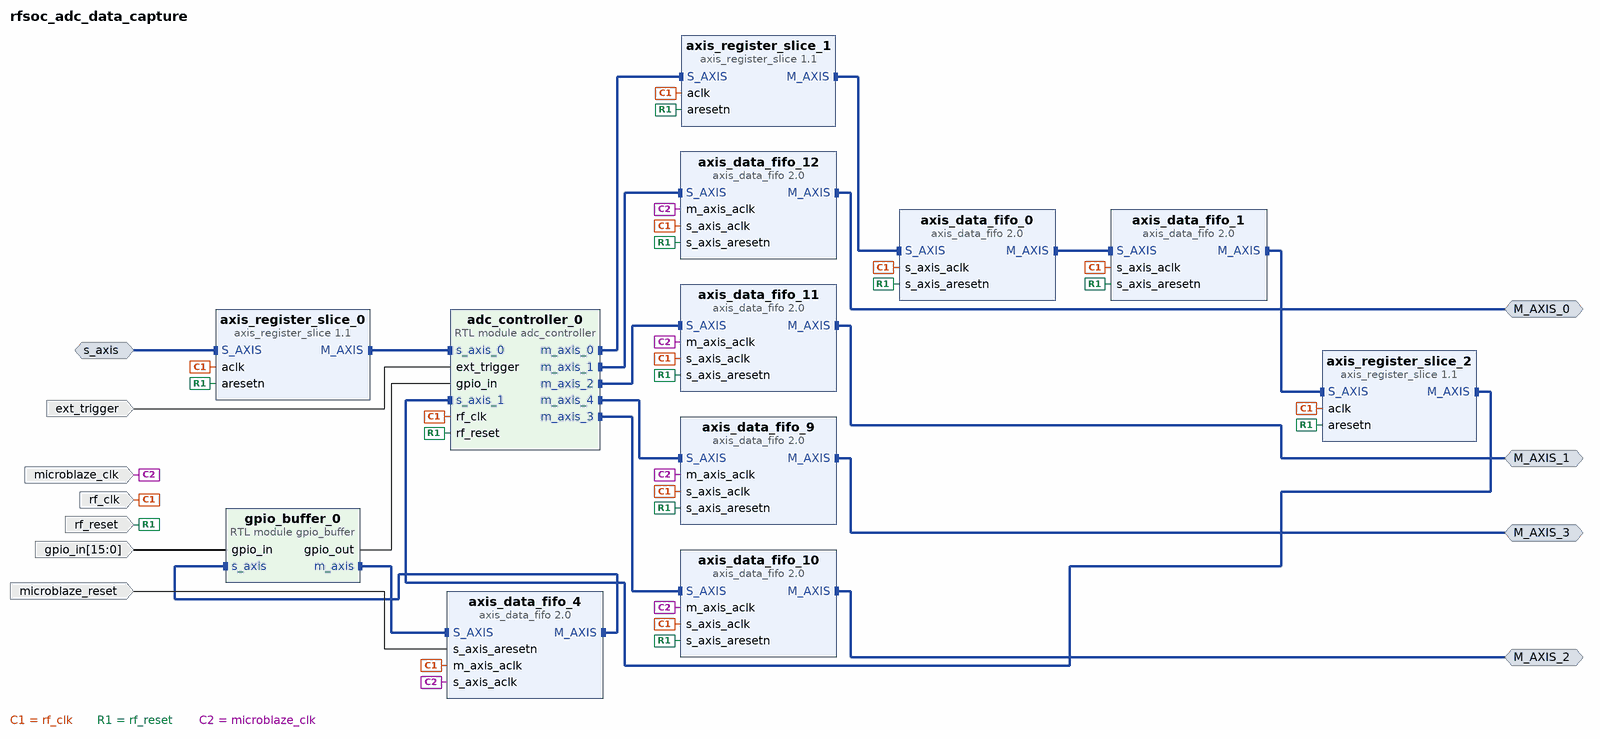
[diagram p0: block diagram of the top level]
# Vivado block design rfsoc_adc_data_capture, xczu29dr-ffvf1760-2-e, Vivado 2019.1
create_bd_design rfsoc_adc_data_capture

create_bd_intf_port -mode Slave -vlnv xilinx.com:interface:axis_rtl:1.0 s_axis
set_property -dict [list \
  CONFIG.FREQ_HZ 250000000 \
  CONFIG.HAS_TKEEP 0 \
  CONFIG.HAS_TLAST 0 \
  CONFIG.HAS_TREADY 1 \
  CONFIG.HAS_TSTRB 0 \
  CONFIG.LAYERED_METADATA undef \
  CONFIG.TDATA_NUM_BYTES 16 \
  CONFIG.TDEST_WIDTH 0 \
  CONFIG.TID_WIDTH 0 \
  CONFIG.TUSER_WIDTH 0 \
] [get_bd_intf_ports s_axis]
create_bd_intf_port -mode Master -vlnv xilinx.com:interface:axis_rtl:1.0 M_AXIS_0
create_bd_intf_port -mode Master -vlnv xilinx.com:interface:axis_rtl:1.0 M_AXIS_1
create_bd_intf_port -mode Master -vlnv xilinx.com:interface:axis_rtl:1.0 M_AXIS_2
create_bd_intf_port -mode Master -vlnv xilinx.com:interface:axis_rtl:1.0 M_AXIS_3
create_bd_port -dir I -type clk rf_clk
set_property -dict {CONFIG.ASSOCIATED_BUSIF s_axis CONFIG.FREQ_HZ 250000000} [get_bd_ports rf_clk]
create_bd_port -dir I -type rst rf_reset
create_bd_port -dir I ext_trigger
create_bd_port -dir I -type clk microblaze_clk
create_bd_port -dir I -type rst microblaze_reset
create_bd_port -dir I -from 15 -to 0 gpio_in

create_bd_cell -type ip -vlnv xilinx.com:ip:axis_data_fifo:2.0 axis_data_fifo_4
set_property -dict {CONFIG.FIFO_DEPTH 16 CONFIG.IS_ACLK_ASYNC 1} [get_bd_cells axis_data_fifo_4]
create_bd_cell -type ip -vlnv xilinx.com:ip:axis_register_slice:1.1 axis_register_slice_0
create_bd_cell -type ip -vlnv xilinx.com:ip:axis_data_fifo:2.0 axis_data_fifo_9
set_property -dict {CONFIG.FIFO_DEPTH 16 CONFIG.IS_ACLK_ASYNC 1 CONFIG.TDATA_NUM_BYTES 4} [get_bd_cells axis_data_fifo_9]
create_bd_cell -type ip -vlnv xilinx.com:ip:axis_data_fifo:2.0 axis_data_fifo_10
set_property -dict {CONFIG.FIFO_DEPTH 16 CONFIG.IS_ACLK_ASYNC 1 CONFIG.TDATA_NUM_BYTES 4} [get_bd_cells axis_data_fifo_10]
create_bd_cell -type ip -vlnv xilinx.com:ip:axis_data_fifo:2.0 axis_data_fifo_11
set_property -dict {CONFIG.FIFO_DEPTH 16 CONFIG.IS_ACLK_ASYNC 1 CONFIG.TDATA_NUM_BYTES 4} [get_bd_cells axis_data_fifo_11]
create_bd_cell -type ip -vlnv xilinx.com:ip:axis_data_fifo:2.0 axis_data_fifo_12
set_property -dict {CONFIG.FIFO_DEPTH 16 CONFIG.IS_ACLK_ASYNC 1 CONFIG.TDATA_NUM_BYTES 4} [get_bd_cells axis_data_fifo_12]
create_bd_cell -type ip -vlnv xilinx.com:ip:axis_data_fifo:2.0 axis_data_fifo_0
set_property -dict {CONFIG.FIFO_DEPTH 32768 CONFIG.TDATA_NUM_BYTES 16} [get_bd_cells axis_data_fifo_0]
create_bd_cell -type ip -vlnv xilinx.com:ip:axis_data_fifo:2.0 axis_data_fifo_1
set_property -dict {CONFIG.FIFO_DEPTH 32768 CONFIG.TDATA_NUM_BYTES 16} [get_bd_cells axis_data_fifo_1]
create_bd_cell -type module -reference adc_controller adc_controller_0
create_bd_cell -type module -reference gpio_buffer gpio_buffer_0
create_bd_cell -type ip -vlnv xilinx.com:ip:axis_register_slice:1.1 axis_register_slice_1
create_bd_cell -type ip -vlnv xilinx.com:ip:axis_register_slice:1.1 axis_register_slice_2

# ---- connections ----

connect_bd_intf_net [get_bd_intf_ports M_AXIS_3] [get_bd_intf_pins axis_data_fifo_9/M_AXIS]
connect_bd_intf_net [get_bd_intf_pins axis_data_fifo_0/M_AXIS] [get_bd_intf_pins axis_data_fifo_1/S_AXIS]
connect_bd_intf_net [get_bd_intf_pins gpio_buffer_0/s_axis] [get_bd_intf_pins axis_data_fifo_4/M_AXIS]
connect_bd_intf_net [get_bd_intf_pins adc_controller_0/m_axis_1] [get_bd_intf_pins axis_data_fifo_12/S_AXIS]
connect_bd_intf_net [get_bd_intf_pins axis_register_slice_0/M_AXIS] [get_bd_intf_pins adc_controller_0/s_axis_0]
connect_bd_intf_net [get_bd_intf_ports s_axis] [get_bd_intf_pins axis_register_slice_0/S_AXIS]
connect_bd_intf_net [get_bd_intf_pins adc_controller_0/m_axis_4] [get_bd_intf_pins axis_data_fifo_9/S_AXIS]
connect_bd_intf_net [get_bd_intf_pins adc_controller_0/m_axis_3] [get_bd_intf_pins axis_data_fifo_10/S_AXIS]
connect_bd_intf_net [get_bd_intf_pins gpio_buffer_0/m_axis] [get_bd_intf_pins axis_data_fifo_4/S_AXIS]
connect_bd_intf_net [get_bd_intf_pins adc_controller_0/m_axis_2] [get_bd_intf_pins axis_data_fifo_11/S_AXIS]
connect_bd_intf_net [get_bd_intf_ports M_AXIS_1] [get_bd_intf_pins axis_data_fifo_11/M_AXIS]
connect_bd_intf_net [get_bd_intf_ports M_AXIS_0] [get_bd_intf_pins axis_data_fifo_12/M_AXIS]
connect_bd_intf_net [get_bd_intf_ports M_AXIS_2] [get_bd_intf_pins axis_data_fifo_10/M_AXIS]
connect_bd_intf_net [get_bd_intf_pins axis_register_slice_1/M_AXIS] [get_bd_intf_pins axis_data_fifo_0/S_AXIS]
connect_bd_intf_net [get_bd_intf_pins axis_data_fifo_1/M_AXIS] [get_bd_intf_pins axis_register_slice_2/S_AXIS]
connect_bd_intf_net [get_bd_intf_pins axis_register_slice_2/M_AXIS] [get_bd_intf_pins adc_controller_0/s_axis_1]
connect_bd_intf_net [get_bd_intf_pins adc_controller_0/m_axis_0] [get_bd_intf_pins axis_register_slice_1/S_AXIS]
connect_bd_net -net rf_clk_0_1 [get_bd_ports rf_clk] \
  [get_bd_pins axis_data_fifo_4/m_axis_aclk] [get_bd_pins axis_register_slice_0/aclk] \
  [get_bd_pins axis_data_fifo_10/s_axis_aclk] [get_bd_pins axis_data_fifo_9/s_axis_aclk] \
  [get_bd_pins axis_data_fifo_11/s_axis_aclk] [get_bd_pins axis_data_fifo_12/s_axis_aclk] \
  [get_bd_pins axis_data_fifo_0/s_axis_aclk] [get_bd_pins axis_data_fifo_1/s_axis_aclk] [get_bd_pins adc_controller_0/rf_clk] \
  [get_bd_pins axis_register_slice_1/aclk] [get_bd_pins axis_register_slice_2/aclk]
connect_bd_net -net rf_reset_0_1 [get_bd_ports rf_reset] \
  [get_bd_pins axis_register_slice_0/aresetn] [get_bd_pins axis_data_fifo_12/s_axis_aresetn] \
  [get_bd_pins axis_data_fifo_11/s_axis_aresetn] [get_bd_pins axis_data_fifo_9/s_axis_aresetn] \
  [get_bd_pins axis_data_fifo_10/s_axis_aresetn] [get_bd_pins axis_data_fifo_0/s_axis_aresetn] \
  [get_bd_pins axis_data_fifo_1/s_axis_aresetn] [get_bd_pins adc_controller_0/rf_reset] \
  [get_bd_pins axis_register_slice_1/aresetn] [get_bd_pins axis_register_slice_2/aresetn]
connect_bd_net -net ext_trigger_0_1 [get_bd_ports ext_trigger] [get_bd_pins adc_controller_0/ext_trigger]
connect_bd_net [get_bd_ports microblaze_clk] \
  [get_bd_pins axis_data_fifo_4/s_axis_aclk] [get_bd_pins axis_data_fifo_10/m_axis_aclk] \
  [get_bd_pins axis_data_fifo_9/m_axis_aclk] [get_bd_pins axis_data_fifo_11/m_axis_aclk] \
  [get_bd_pins axis_data_fifo_12/m_axis_aclk]
connect_bd_net [get_bd_pins gpio_buffer_0/gpio_out] [get_bd_pins adc_controller_0/gpio_in]
connect_bd_net -net s_axis_aresetn_0_1 [get_bd_ports microblaze_reset] [get_bd_pins axis_data_fifo_4/s_axis_aresetn]
connect_bd_net -net gpio_in_0_1 [get_bd_ports gpio_in] [get_bd_pins gpio_buffer_0/gpio_in]

validate_bd_design
save_bd_design
